# Altium schematic sheet 14.SchDoc
size 513 x 386 mm
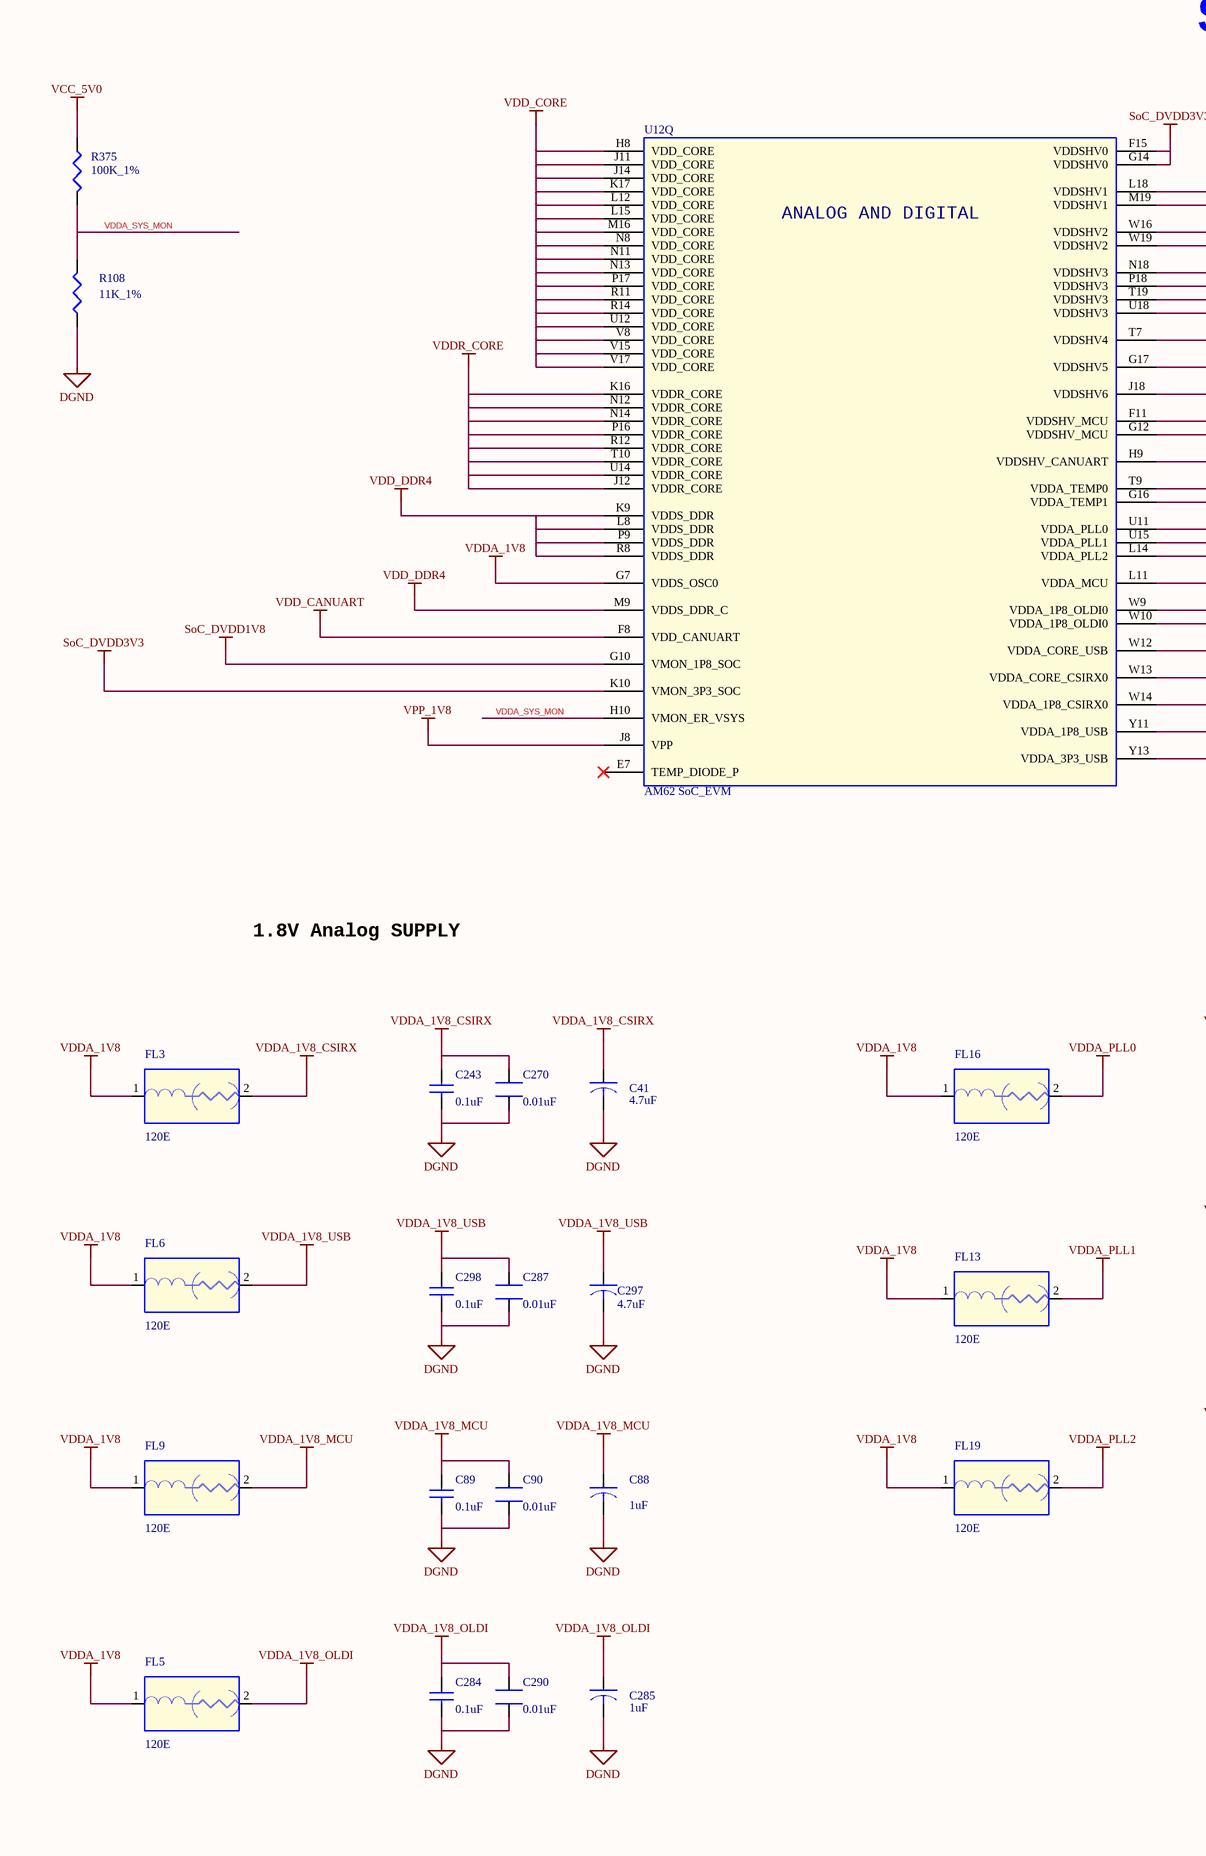
[diagram p0: 14.SchDoc, left]
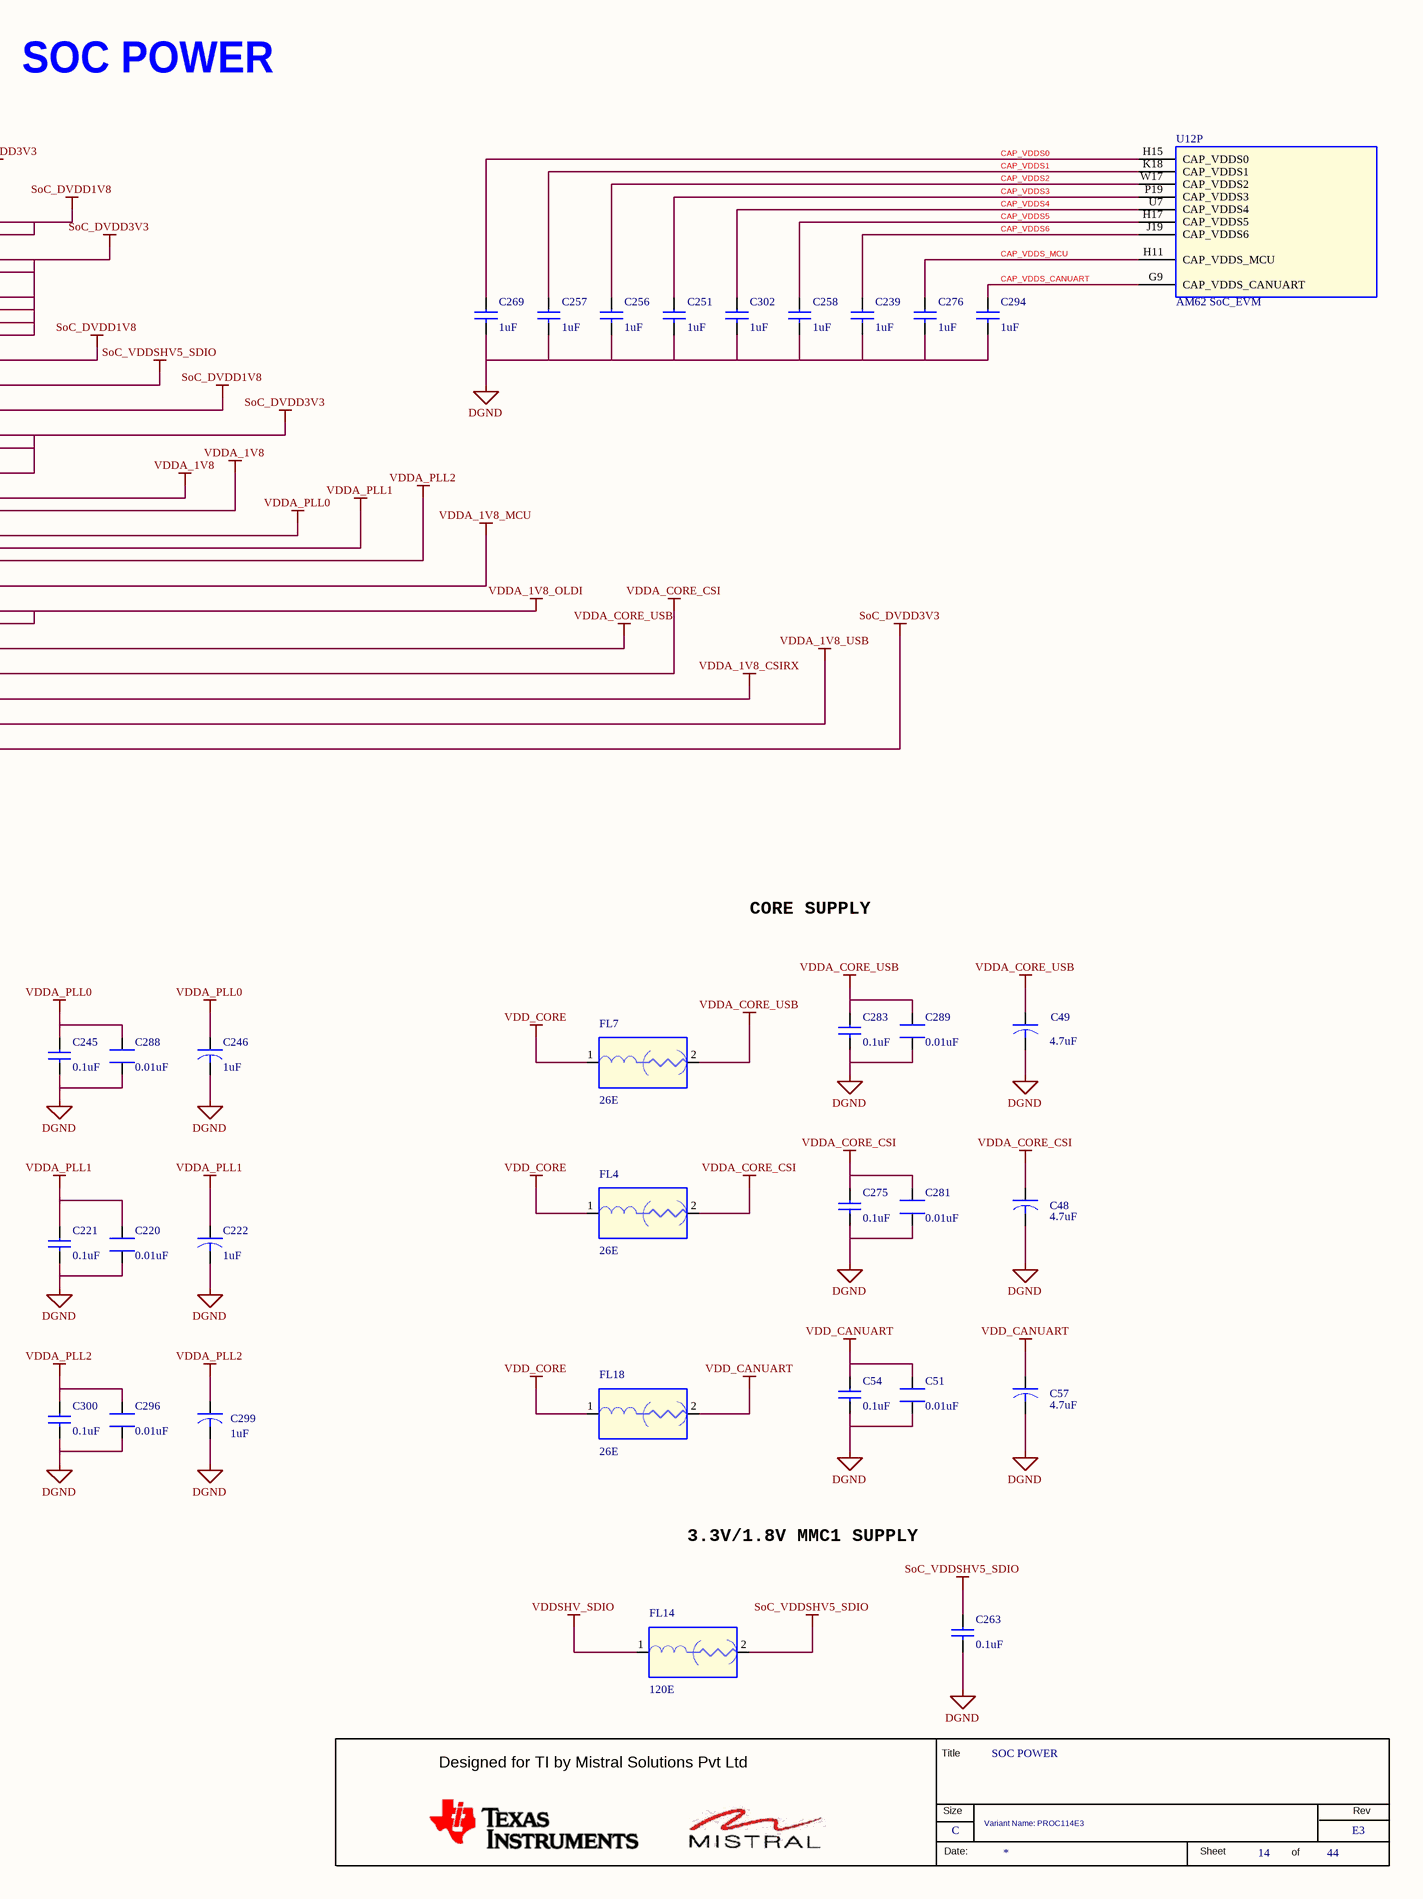
[diagram p1: 14.SchDoc, right]

## Parts
(Parts that share a designator on the sheet are numbered #1, #2 ... from top to bottom, then left to right.)
*  RevCode: E3  Title: SOC POWER  Page Size: C  Page Number: 14  Page Count: 44  Variant Name: PROC114E3  (hidden comment: MISTRAL_TITLEBLK_CSIZE)  (graphical)
C41  4.7uF  [CAP0402_0-75]
C48  4.7uF  [CAP0402_0-75]
C49  4.7uF  [CAP0402_0-75]
C51  0.01uF  [CAP0402N]
C54  0.1uF  [CAP0201_0-5]
C57  4.7uF  [CAP0402_0-75]
C88  1uF  [CAP0201_0-5]
C89  0.1uF  [CAP0201_0-5]
C90  0.01uF  [CAP0402N]
C220  0.01uF  [CAP0402N]
C221  0.1uF  [CAP0201_0-5]
C222  1uF  [CAP0201_0-5]
C239  1uF  [CAP0201_0-5]
C243  0.1uF  [CAP0201_0-5]
C245  0.1uF  [CAP0201_0-5]
C246  1uF  [CAP0201_0-5]
C251  1uF  [CAP0201_0-5]
C256  1uF  [CAP0201_0-5]
C257  1uF  [CAP0201_0-5]
C258  1uF  [CAP0201_0-5]
C263  0.1uF  [CAP0201_0-5]
C269  1uF  [CAP0201_0-5]
C270  0.01uF  [CAP0402N]
C275  0.1uF  [CAP0201_0-5]
C276  1uF  [CAP0201_0-5]
C281  0.01uF  [CAP0402N]
C283  0.1uF  [CAP0201_0-5]
C284  0.1uF  [CAP0201_0-5]
C285  1uF  [CAP0201_0-5]
C287  0.01uF  [CAP0402N]
C288  0.01uF  [CAP0402N]
C289  0.01uF  [CAP0402N]
C290  0.01uF  [CAP0402N]
C294  1uF  [CAP0201_0-5]
C296  0.01uF  [CAP0402N]
C297  4.7uF  [CAP0402_0-75]
C298  0.1uF  [CAP0201_0-5]
C299  1uF  [CAP0201_0-5]
C300  0.1uF  [CAP0201_0-5]
C302  1uF  [CAP0201_0-5]
FL3  120E  [EMIFIL_BLM15A_0402_0-6]
FL4  26E  [EMIFIL_BLM18K_0603_0-7]
FL5  120E  [EMIFIL_BLM15A_0402_0-6]
FL6  120E  [EMIFIL_BLM15A_0402_0-6]
FL7  26E  [EMIFIL_BLM18K_0603_0-7]
FL9  120E  [EMIFIL_BLM15A_0402_0-6]
FL13  120E  [EMIFIL_BLM15A_0402_0-6]
FL14  120E  [EMIFIL_BLM15A_0402_0-6]
FL16  120E  [EMIFIL_BLM15A_0402_0-6]
FL18  26E  [EMIFIL_BLM18K_0603_0-7]
FL19  120E  [EMIFIL_BLM15A_0402_0-6]
R108  11K_1%  [RES0402_0-5]
R375  100K_1%  [RES0402_0-5]
U12#1  AM62 SoC_EVM  [BGA425_19-68_510X510_0-7]  (part P of 18)
U12#2  AM62 SoC_EVM  [BGA425_19-68_510X510_0-7]  (part Q of 18)

## Nets
DGND: C41.2 C48.2 C49.2 C51.2 C54.2 C57.2 C88.2 C89.2 C90.2 C220.2 C221.2 C222.2 C239.2 C243.2 C245.2 C246.2 C251.2 C256.2 C257.2 C258.2 C263.2 C269.2 C270.2 C275.2 C276.2 C281.2 C283.2 C284.2 C285.2 C287.2 C288.2 C289.2 C290.2 C294.2 C296.2 C297.2 C298.2 C299.2 C300.2 C302.2 R108.2
SoC_DVDD1V8: U12#2.G10(VMON_1P8_SOC) U12#2.J18(VDDSHV6) U12#2.L18(VDDSHV1) U12#2.M19(VDDSHV1) U12#2.T7(VDDSHV4)
SoC_DVDD3V3: U12#2.F11(VDDSHV_MCU) U12#2.F15(VDDSHV0) U12#2.G12(VDDSHV_MCU) U12#2.G14(VDDSHV0) U12#2.H9(VDDSHV_CANUART) U12#2.K10(VMON_3P3_SOC) U12#2.N18(VDDSHV3) U12#2.P18(VDDSHV3) U12#2.T19(VDDSHV3) U12#2.U18(VDDSHV3) U12#2.W16(VDDSHV2) U12#2.W19(VDDSHV2) U12#2.Y13(VDDA_3P3_USB)
SoC_VDDSHV5_SDIO: C263.1 FL14.2 U12#2.G17(VDDSHV5)
VCC_5V0: R375.1
VDD_CANUART: C51.1 C54.1 C57.1 FL18.2 U12#2.F8(VDD_CANUART)
VDD_CORE: FL4.1 FL7.1 FL18.1 U12#2.H8(VDD_CORE) U12#2.J11(VDD_CORE) U12#2.J14(VDD_CORE) U12#2.K17(VDD_CORE) U12#2.L12(VDD_CORE) U12#2.L15(VDD_CORE) U12#2.M16(VDD_CORE) U12#2.N8(VDD_CORE) U12#2.N11(VDD_CORE) U12#2.N13(VDD_CORE) U12#2.P17(VDD_CORE) U12#2.R11(VDD_CORE) U12#2.R14(VDD_CORE) U12#2.U12(VDD_CORE) U12#2.V8(VDD_CORE) U12#2.V15(VDD_CORE) U12#2.V17(VDD_CORE)
VDD_DDR4: U12#2.K9(VDDS_DDR) U12#2.L8(VDDS_DDR) U12#2.M9(VDDS_DDR_C) U12#2.P9(VDDS_DDR) U12#2.R8(VDDS_DDR)
VDDA_1V8: FL3.1 FL5.1 FL6.1 FL9.1 FL13.1 FL16.1 FL19.1 U12#2.G7(VDDS_OSC0) U12#2.G16(VDDA_TEMP1) U12#2.T9(VDDA_TEMP0)
VDDA_1V8_CSIRX: C41.1 C243.1 C270.1 FL3.2 U12#2.W14(VDDA_1P8_CSIRX0)
VDDA_1V8_MCU: C88.1 C89.1 C90.1 FL9.2 U12#2.L11(VDDA_MCU)
VDDA_1V8_OLDI: C284.1 C285.1 C290.1 FL5.2 U12#2.W9(VDDA_1P8_OLDI0) U12#2.W10(VDDA_1P8_OLDI0)
VDDA_1V8_USB: C287.1 C297.1 C298.1 FL6.2 U12#2.Y11(VDDA_1P8_USB)
VDDA_CORE_CSI: C48.1 C275.1 C281.1 FL4.2 U12#2.W13(VDDA_CORE_CSIRX0)
VDDA_CORE_USB: C49.1 C283.1 C289.1 FL7.2 U12#2.W12(VDDA_CORE_USB)
VDDA_PLL0: C245.1 C246.1 C288.1 FL16.2 U12#2.U11(VDDA_PLL0)
VDDA_PLL1: C220.1 C221.1 C222.1 FL13.2 U12#2.U15(VDDA_PLL1)
VDDA_PLL2: C296.1 C299.1 C300.1 FL19.2 U12#2.L14(VDDA_PLL2)
VDDR_CORE: U12#2.J12(VDDR_CORE) U12#2.K16(VDDR_CORE) U12#2.N12(VDDR_CORE) U12#2.N14(VDDR_CORE) U12#2.P16(VDDR_CORE) U12#2.R12(VDDR_CORE) U12#2.T10(VDDR_CORE) U12#2.U14(VDDR_CORE)
VDDSHV_SDIO: FL14.1
VPP_1V8: U12#2.J8(VPP)
CAP_VDDS0: C269.1 U12#1.H15(CAP_VDDS0)
CAP_VDDS1: C257.1 U12#1.K18(CAP_VDDS1)
CAP_VDDS2: C256.1 U12#1.W17(CAP_VDDS2)
CAP_VDDS3: C251.1 U12#1.P19(CAP_VDDS3)
CAP_VDDS4: C302.1 U12#1.U7(CAP_VDDS4)
CAP_VDDS5: C258.1 U12#1.H17(CAP_VDDS5)
CAP_VDDS6: C239.1 U12#1.J19(CAP_VDDS6)
CAP_VDDS_CANUART: C294.1 U12#1.G9(CAP_VDDS_CANUART)
CAP_VDDS_MCU: C276.1 U12#1.H11(CAP_VDDS_MCU)
VDDA_SYS_MON: R108.1 R375.2 U12#2.H10(VMON_ER_VSYS)

Not connected (* = marked no-connect by the designer): U12#2 E7(TEMP_DIODE_P)*

## Notes on the sheet
- SOC POWER
- 1.8V Analog SUPPLY
- CORE SUPPLY
- 3.3V/1.8V MMC1 SUPPLY
- (in symbol AM62-EVM_BGA425, part Q) ANALOG AND DIGITAL
- (in symbol MISTRAL_TITLEBLK_CSIZE) Title; Designed for TI by Mistral Solutions Pvt Ltd; Size; Rev; Date:; Sheet; of

## Library data of the parts
* = MISTRAL_TITLEBLK_CSIZE: Issue: 1.0; Page Create Date: March  8, 1995; Page Modify Date: *; Schematic Page Count: 44; Schematic Page Number: 14
C41 = CAP_Dup1: CAP CERAMIC 4.7uF 10V 20% X5R 0402; Part_type: CAPACITORS\CERAMIC; Mfr_part_number: GRM155R61A475MEAAD; Mfr_name: MURATA; Mistral Part No: 120012060002-R; Custom_Duty: 15%; Customs_HS_Code: 85322990; Wattage: NA; Project: TI_J7SVB_PCIE_ADD-ON-CARD; Footprint Path: Y:\MIS_DATABASE\Library\ALTIUM_TOOL\PCB_FOOTPRINTS\Altium_Footprint_Lib.PcbLib; Library Path: Y:\MIS_DATABASE\Library\ALTIUM_TOOL\SCHEMATICS_PARTS\MS_DISCRETE_Library.schlib; MECHANICAL 3D STEP FILE: CAP0402_0-75; Chkd/date: MANIRAJA/110718; Crtd /date: ALVY/110718; Datasheet: Y:\MIS_DATABASE\DATASHEETS\CAPACITORS\GRM155R61A475MEAAD.PDF; Temperature: -55°C+85°C; Weight: 14mg; Height: 0.65MM; Library Ref: CAP; Distributor_part_number: 490-14306-1-ND; Distributor_name: DIGIKEY; Package: 0402; Voltage: 10V; Tolerance: 20%; Footprint Ref: CAP0402_0-75; PCB Footprint: CAP0402_0-75
C48 C49 C57 C297 = CAP_Dup1: CAP CERAMIC 4.7uF 10V 20% X5R 0402; Mistral Part No: 120012060002-R; Mfr_name: MURATA; Mfr_part_number: GRM155R61A475MEAAD; Part_type: CAPACITORS\CERAMIC; Project: TI_J7SVB_PCIE_ADD-ON-CARD; Wattage: NA; Customs_HS_Code: 85322990; Custom_Duty: 15%; PCB Footprint: CAP0402_0-75; Footprint Ref: CAP0402_0-75; Tolerance: 20%; Voltage: 10V; Package: 0402; Distributor_name: DIGIKEY; Distributor_part_number: 490-14306-1-ND; Library Ref: CAP; Height: 0.65MM; Weight: 14mg; Temperature: -55°C+85°C; Datasheet: Y:\MIS_DATABASE\DATASHEETS\CAPACITORS\GRM155R61A475MEAAD.PDF; Crtd /date: ALVY/110718; Chkd/date: MANIRAJA/110718; MECHANICAL 3D STEP FILE: CAP0402_0-75; Library Path: Y:\MIS_DATABASE\Library\ALTIUM_TOOL\SCHEMATICS_PARTS\MS_DISCRETE_Library.schlib; Footprint Path: Y:\MIS_DATABASE\Library\ALTIUM_TOOL\PCB_FOOTPRINTS\Altium_Footprint_Lib.PcbLib
C51 C288 = CAP_Dup3: CAP CERAMIC 0.01uF 25V 10% X5R 0201; Part_type: CAPACITORS\CERAMIC; Mfr_part_number: GRM033R61E103KA12J; Mfr_name: MURATA; Mistral Part No: 120018010007-R; PCB Footprint: CAP0201_0-5; Wattage: NA; Custom_Duty: 15%; Customs_HS_Code: 85322990; Project: TI_MAXIE_CPB; Footprint Path: Y:\MIS_DATABASE\Library\ALTIUM_TOOL\PCB_FOOTPRINTS\Altium_Footprint_Lib.PcbLib; Library Path: Y:\MIS_DATABASE\Library\ALTIUM_TOOL\SCHEMATICS_PARTS\MS_DISCRETE_Library.schlib; Footprint Ref: CAP0201_0-5; Library Ref: CAP; MECHANICAL 3D STEP FILE: CAP0201_0-5; Temperature: -55°C+85°C; Weight: 0.33mg; Chkd/date: MANIRAJA/230118; Crtd /date: MANIRAJA/230118; Datasheet: Y:\MIS_DATABASE\DATASHEETS\CAPACITORS\GRM033R61E103KA12.PDF; Height: 0.33MM; Distributor_part_number: GRM033R61E103KA12J-ND; Distributor_name: DIGIKEY; Package: 0201; Voltage: 25V; Tolerance: 10%
C54 C89 C243 C245 C275 C283 C284 C298 = CAP_Dup2: CAP CERAMIC 0.1uF 16V 10% X5R 0201; Part_type: CAPACITORS\CERAMIC; Mfr_part_number: GRM033R61C104KE14D; Mfr_name: MURATA; Mistral Part No: 120009030072-R; Custom_Duty: 15%; Customs_HS_Code: 85322990; Wattage: NA; Project: TI_MAXIE_CPB; PCB Footprint: CAP0201_0-5; Footprint Path: Y:\MIS_DATABASE\Library\ALTIUM_TOOL\PCB_FOOTPRINTS\Altium_Footprint_Lib.PcbLib; Library Path: Y:\MIS_DATABASE\Library\ALTIUM_TOOL\SCHEMATICS_PARTS\MS_DISCRETE_Library.schlib; Footprint Ref: CAP0201_0-5; MECHANICAL 3D STEP FILE: CAP0201_0-5; Chkd/date: MANIRAJA/230118; Crtd /date: MANIRAJA/230118; Datasheet: Y:\MIS_DATABASE\DATASHEETS\CAPACITORS\GRM033R61C104KE14.PDF; Temperature: -55°C+85°C; Weight: 0.33mg; Height: 0.33MM; Distributor_part_number: 490-14305-1-ND; Distributor_name: DIGIKEY; Package: 0201; Voltage: 16V; Tolerance: 10%; Library Ref: CAP
C88 C222 C285 C299 = CAP_Dup1: CAP CERAMIC 1uF 16V 20% X5R 0201; Part_type: CAPACITORS\CERAMIC; Mfr_part_number: GRM033R61C105ME15D; Mfr_name: MURATA; Mistral Part No: 120018090038-R; Custom_Duty: 15%; Customs_HS_Code: 85322990; Wattage: NA; Project: QCS610_NANOSOM; PCB Footprint: CAP0201_0-5; Footprint Path: Y:\MIS_DATABASE\Library\ALTIUM_TOOL\PCB_FOOTPRINTS\Altium_Footprint_Lib.PcbLib; Library Path: Y:\MIS_DATABASE\Library\ALTIUM_TOOL\SCHEMATICS_PARTS\MS_DISCRETE_Library.schlib; MECHANICAL 3D STEP FILE: CAP0201_0-5; Chkd/date: MANIRAJA/300520; Crtd /date: ALVY/260520; Datasheet: Y:\MIS_DATABASE\DATASHEETS\CAPACITORS\GRM033R61C105ME15.PDF; Temperature: -55°C+85°C; Weight: 0.33mg; Height: 0.39MM; Library Ref: CAP; Distributor_part_number: 490-18654-1-ND; Distributor_name: DIGIKEY; Package: 0201; Voltage: 16V; Tolerance: 20%; Footprint Ref: CAP0201_0-5
C90 C220 C270 C281 C287 C289 C290 C296 = CAP_Dup3: CAP CERAMIC 0.01uF 25V 10% X5R 0201; Mistral Part No: 120018010007-R; Mfr_name: MURATA; Mfr_part_number: GRM033R61E103KA12J; Part_type: CAPACITORS\CERAMIC; PCB Footprint: CAP0201_0-5; Project: TI_MAXIE_CPB; Customs_HS_Code: 85322990; Custom_Duty: 15%; Wattage: NA; Footprint Path: Y:\MIS_DATABASE\Library\ALTIUM_TOOL\PCB_FOOTPRINTS\Altium_Footprint_Lib.PcbLib; Library Path: Y:\MIS_DATABASE\Library\ALTIUM_TOOL\SCHEMATICS_PARTS\MS_DISCRETE_Library.schlib; Footprint Ref: CAP0201_0-5; Tolerance: 10%; Voltage: 25V; Package: 0201; Distributor_name: DIGIKEY; Distributor_part_number: GRM033R61E103KA12J-ND; Height: 0.33MM; Datasheet: Y:\MIS_DATABASE\DATASHEETS\CAPACITORS\GRM033R61E103KA12.PDF; Crtd /date: MANIRAJA/230118; Chkd/date: MANIRAJA/230118; Weight: 0.33mg; Temperature: -55°C+85°C; MECHANICAL 3D STEP FILE: CAP0201_0-5; Library Ref: CAP
C221 C263 C300 = CAP_Dup2: CAP CERAMIC 0.1uF 16V 10% X5R 0201; Mistral Part No: 120009030072-R; Mfr_name: MURATA; Mfr_part_number: GRM033R61C104KE14D; Part_type: CAPACITORS\CERAMIC; Project: TI_MAXIE_CPB; Wattage: NA; Customs_HS_Code: 85322990; Custom_Duty: 15%; PCB Footprint: CAP0201_0-5; Tolerance: 10%; Voltage: 16V; Package: 0201; Distributor_name: DIGIKEY; Distributor_part_number: 490-14305-1-ND; Height: 0.33MM; Weight: 0.33mg; Temperature: -55°C+85°C; Datasheet: Y:\MIS_DATABASE\DATASHEETS\CAPACITORS\GRM033R61C104KE14.PDF; Crtd /date: MANIRAJA/230118; Chkd/date: MANIRAJA/230118; MECHANICAL 3D STEP FILE: CAP0201_0-5; Library Ref: CAP; Footprint Ref: CAP0201_0-5; Library Path: Y:\MIS_DATABASE\Library\ALTIUM_TOOL\SCHEMATICS_PARTS\MS_DISCRETE_Library.schlib; Footprint Path: Y:\MIS_DATABASE\Library\ALTIUM_TOOL\PCB_FOOTPRINTS\Altium_Footprint_Lib.PcbLib
C239 C251 C257 C294 C302 = CAP_Dup2: CAP CERAMIC 1uF 16V 20% X5R 0201; Mistral Part No: 120018090038-R; Mfr_name: MURATA; Mfr_part_number: GRM033R61C105ME15D; Part_type: CAPACITORS\CERAMIC; Project: QCS610_NANOSOM; Wattage: NA; Customs_HS_Code: 85322990; Custom_Duty: 15%; PCB Footprint: CAP0201_0-5; Footprint Ref: CAP0201_0-5; Tolerance: 20%; Voltage: 16V; Package: 0201; Distributor_name: DIGIKEY; Distributor_part_number: 490-18654-1-ND; Library Ref: CAP; Height: 0.39MM; Weight: 0.33mg; Temperature: -55°C+85°C; Datasheet: Y:\MIS_DATABASE\DATASHEETS\CAPACITORS\GRM033R61C105ME15.PDF; Crtd /date: ALVY/260520; Chkd/date: MANIRAJA/300520; MECHANICAL 3D STEP FILE: CAP0201_0-5; Library Path: Y:\MIS_DATABASE\Library\ALTIUM_TOOL\SCHEMATICS_PARTS\MS_DISCRETE_Library.schlib; Footprint Path: Y:\MIS_DATABASE\Library\ALTIUM_TOOL\PCB_FOOTPRINTS\Altium_Footprint_Lib.PcbLib
C246 = CAP_Dup1: CAP CERAMIC 1uF 16V 20% X5R 0201; Mistral Part No: 120018090038-R; Mfr_name: MURATA; Mfr_part_number: GRM033R61C105ME15D; Part_type: CAPACITORS\CERAMIC; Project: QCS610_NANOSOM; Wattage: NA; Customs_HS_Code: 85322990; Custom_Duty: 15%; PCB Footprint: CAP0201_0-5; Footprint Ref: CAP0201_0-5; Tolerance: 20%; Voltage: 16V; Package: 0201; Distributor_name: DIGIKEY; Distributor_part_number: 490-18654-1-ND; Library Ref: CAP; Height: 0.39MM; Weight: 0.33mg; Temperature: -55°C+85°C; Datasheet: Y:\MIS_DATABASE\DATASHEETS\CAPACITORS\GRM033R61C105ME15.PDF; Crtd /date: ALVY/260520; Chkd/date: MANIRAJA/300520; MECHANICAL 3D STEP FILE: CAP0201_0-5; Library Path: Y:\MIS_DATABASE\Library\ALTIUM_TOOL\SCHEMATICS_PARTS\MS_DISCRETE_Library.schlib; Footprint Path: Y:\MIS_DATABASE\Library\ALTIUM_TOOL\PCB_FOOTPRINTS\Altium_Footprint_Lib.PcbLib
C256 C258 C269 C276 = CAP_Dup2: CAP CERAMIC 1uF 16V 20% X5R 0201; Part_type: CAPACITORS\CERAMIC; Mfr_part_number: GRM033R61C105ME15D; Mfr_name: MURATA; Mistral Part No: 120018090038-R; Custom_Duty: 15%; Customs_HS_Code: 85322990; Wattage: NA; Project: QCS610_NANOSOM; PCB Footprint: CAP0201_0-5; Footprint Path: Y:\MIS_DATABASE\Library\ALTIUM_TOOL\PCB_FOOTPRINTS\Altium_Footprint_Lib.PcbLib; Library Path: Y:\MIS_DATABASE\Library\ALTIUM_TOOL\SCHEMATICS_PARTS\MS_DISCRETE_Library.schlib; MECHANICAL 3D STEP FILE: CAP0201_0-5; Chkd/date: MANIRAJA/300520; Crtd /date: ALVY/260520; Datasheet: Y:\MIS_DATABASE\DATASHEETS\CAPACITORS\GRM033R61C105ME15.PDF; Temperature: -55°C+85°C; Weight: 0.33mg; Height: 0.39MM; Library Ref: CAP; Distributor_part_number: 490-18654-1-ND; Distributor_name: DIGIKEY; Package: 0201; Voltage: 16V; Tolerance: 20%; Footprint Ref: CAP0201_0-5
FL3 FL9 FL14 = EMIFILTER_IND: IND FERRITE BEAD CHIP 120E 2A 0402; Mistral Part No: 130013060022-R; Mfr_name: MURATA; Mfr_part_number: BLM15PX121SN1D; Part_type: INDUCTOR; Project: GEN_3-8; Tolerance: 25%; Voltage: NA; Customs_HS_Code: 85369090; Custom_Duty: 24%; Footprint Ref: EMIFIL_BLM15A_0402_0-6; Wattage: NA; Package: 0402; Distributor_name: DIGIKEY; Distributor_part_number: 490-9656-1-ND; Library Ref: EMIFILTER_IND; Height: 0.55MM; Weight: 1mg; Temperature: -55°C+125°C; Datasheet: Y:\MIS_DATABASE\DATASHEETS\DISCRETES\INDUCTORS\BLM15-SN1-SER.PDF; Crtd /date: USMAN/170613; Chkd/date: NAVEED/241114; MECHANICAL 3D STEP FILE: EMIFIL_BLM15A_0402_0-6; Library Path: Y:\MIS_DATABASE\Library\ALTIUM_TOOL\SCHEMATICS_PARTS\MS_FILTER_Library.schlib; Footprint Path: Y:\MIS_DATABASE\Library\ALTIUM_TOOL\PCB_FOOTPRINTS\Altium_Footprint_Lib.PcbLib; PCB Footprint: EMIFIL_BLM15A_0402_0-6
FL4 = EMIFILTER_IND: FERRITE CHIP 26E 6A 0603; Mistral Part No: 130013100028-R; Mfr_name: MURATA; Mfr_part_number: BLM18SG260TN1D; Part_type: FILTER; Project: DTRM_SBAND; Tolerance: 25%; Voltage: NA; Customs_HS_Code: 85412900; Custom_Duty: 15%; Wattage: NA; Package: 0603; Distributor_name: DIGIKEY; Distributor_part_number: 490-3995-1-ND; Library Ref: EMIFILTER_IND; Height: 0.65MM; Weight: 2mg; Temperature: -55°C+125°C; Datasheet: Y:\MIS_DATABASE\DATASHEETS\DISCRETES\INDUCTORS\BLM18K-SERIES.PDF; Crtd /date: USMAN/251013; Chkd/date: NAVEED/190115; MECHANICAL 3D STEP FILE: EMIFIL_BLM18K_0603_0-7; PCB Footprint: EMIFIL_BLM18K_0603_0-7
FL5 FL6 FL13 FL16 FL19 = EMIFILTER_IND: IND FERRITE BEAD CHIP 120E 2A 0402; Part_type: INDUCTOR; Mfr_part_number: BLM15PX121SN1D; Mfr_name: MURATA; Mistral Part No: 130013060022-R; Custom_Duty: 24%; Customs_HS_Code: 85369090; Wattage: NA; Tolerance: 25%; Project: GEN_3-8; Footprint Path: Y:\MIS_DATABASE\Library\ALTIUM_TOOL\PCB_FOOTPRINTS\Altium_Footprint_Lib.PcbLib; Library Path: Y:\MIS_DATABASE\Library\ALTIUM_TOOL\SCHEMATICS_PARTS\MS_FILTER_Library.schlib; MECHANICAL 3D STEP FILE: EMIFIL_BLM15A_0402_0-6; Chkd/date: NAVEED/241114; Crtd /date: USMAN/170613; Datasheet: Y:\MIS_DATABASE\DATASHEETS\DISCRETES\INDUCTORS\BLM15-SN1-SER.PDF; Temperature: -55°C+125°C; Weight: 1mg; Height: 0.55MM; Library Ref: EMIFILTER_IND; Distributor_part_number: 490-9656-1-ND; Distributor_name: DIGIKEY; Package: 0402; Voltage: NA; Footprint Ref: EMIFIL_BLM15A_0402_0-6; PCB Footprint: EMIFIL_BLM15A_0402_0-6
FL7 FL18 = EMIFILTER_IND: FERRITE CHIP 26E 6A 0603; Part_type: FILTER; Mfr_part_number: BLM18SG260TN1D; Mfr_name: MURATA; Mistral Part No: 130013100028-R; Custom_Duty: 15%; Customs_HS_Code: 85412900; Wattage: NA; Tolerance: 25%; Project: DTRM_SBAND; MECHANICAL 3D STEP FILE: EMIFIL_BLM18K_0603_0-7; Chkd/date: NAVEED/190115; Crtd /date: USMAN/251013; Datasheet: Y:\MIS_DATABASE\DATASHEETS\DISCRETES\INDUCTORS\BLM18K-SERIES.PDF; Temperature: -55°C+125°C; Weight: 2mg; Height: 0.65MM; Library Ref: EMIFILTER_IND; Distributor_part_number: 490-3995-1-ND; Distributor_name: DIGIKEY; Package: 0603; Voltage: NA; PCB Footprint: EMIFIL_BLM18K_0603_0-7
R108 = RESISTOR_Dup6: RES 11K 1/16W 1% 0402; Mistral Part No: 110015110012-R; Mfr_name: YAGEO AMERICA; Mfr_part_number: RC0402FR-0711KL; Part_type: RESISTORS\FIXED; Project: TI_VLAN_SWITCH; Voltage: NA; Customs_HS_Code: 85332119; Custom_Duty: 15%; Library Ref: RESISTOR; Tolerance: 1%; Wattage: 1/16W; Package: 0402; Distributor_name: DIGIKEY; Distributor_part_number: 311-11.0KLRCT-ND; Height: 0.40MM; Weight: 0.65mg; Temperature: -55°C+155°C; Datasheet: Y:\MIS_DATABASE\DATASHEETS\RESISTORS\RCXXXXL-SER_MAR18.PDF; Crtd /date: VASANTHA/251115; Chkd/date: VASANTHA/251115; MECHANICAL 3D STEP FILE: RES0402_0-5; Footprint Ref: RES0402_0-5; Library Path: Y:\MIS_DATABASE\Library\ALTIUM_TOOL\SCHEMATICS_PARTS\MS_DISCRETE_Library.schlib; Footprint Path: Y:\MIS_DATABASE\Library\ALTIUM_TOOL\PCB_FOOTPRINTS\Altium_Footprint_Lib.PcbLib; PCB Footprint: RES0402_0-5
R375 = RESISTOR_Dup4: RES 100K 1/10W 1% 0402; Part_type: RESISTORS\FIXED; Mfr_part_number: ERJ-2RKF1003X; Mfr_name: PANASONIC-ECG; Mistral Part No: 110009030187-R; Custom_Duty: 15%; Customs_HS_Code: 85332119; Voltage: NA; Project: J32; Chkd/date: VASANTHA/201216; Crtd /date: MAZHAR/130306; Datasheet: Y:\MIS_DATABASE\DATASHEETS\RESISTORS\PAN-ERJSER_NOV17.PDF; Temperature: -55°C+155°C; Weight: 0.8mg; Height: 0.40MM; Distributor_part_number: P100KLCT-ND; Distributor_name: DIGIKEY; Package: 0402; Wattage: 1/10W; Tolerance: 1%; MECHANICAL 3D STEP FILE: RES0402_0-5; Library Ref: RESISTOR; Footprint Ref: RES0402_0-5; Library Path: Y:\MIS_DATABASE\Library\ALTIUM_TOOL\SCHEMATICS_PARTS\MS_DISCRETE_Library.schlib; Footprint Path: Y:\MIS_DATABASE\Library\ALTIUM_TOOL\PCB_FOOTPRINTS\Altium_Footprint_Lib.PcbLib; PCB Footprint: RES0402_0-5
U12#1 = AM62-EVM_BGA425_Dup1: IC AM62 SoC MICROPROCESSOR BGA425; Part_type: ICS\DIGITAL\MICROPROCESSOR; Mfr_name: TEXAS INSTRUMENTS; Mistral Part No: 141221060001; Custom_Duty: 15%; Customs_HS_Code: 85423100; Wattage: NA; Project: AM62_EVM_BRD; Footprint Path: Y:\MIS_DATABASE\Library\ALTIUM_TOOL\PCB_FOOTPRINTS\Altium_Footprint_Lib.PcbLib; Library Path: Y:\MIS_DATABASE\Library\ALTIUM_TOOL\SCHEMATICS_PARTS\MS_MICROPROCESSOR_Library.schlib; MECHANICAL 3D STEP FILE: BGA425_19-68_510X510_0-7; RoHS: NA; Chkd/date: ALVY/110621; Crtd /date: MANIRAJA/110621; Datasheet: Y:\MIS_DATABASE\DATASHEETS\ICS\DIGITAL\MICROCONTROLLER\AM62-SoC_SVB.PDF; Temperature: NA; Weight: NA; Height: 0.65MM; Footprint Ref: BGA425_19-68_510X510_0-7; Library Ref: AM62-EVM_BGA425; Distributor_part_number: NA; Distributor_name: NA; Package: BGA425; Voltage: NA; Tolerance: NA; Mfr_part_number: AM62 SoC_EVM; PCB Footprint: BGA425_19-68_510X510_0-7
U12#2 = AM62-EVM_BGA425: IC AM62 SoC MICROPROCESSOR BGA425; Part_type: ICS\DIGITAL\MICROPROCESSOR; Mfr_name: TEXAS INSTRUMENTS; Mistral Part No: 141221060001; Custom_Duty: 15%; Customs_HS_Code: 85423100; Wattage: NA; Project: AM62_EVM_BRD; PCB Footprint: BGA425_19-68_510X510_0-7; Footprint Path: Y:\MIS_DATABASE\Library\ALTIUM_TOOL\PCB_FOOTPRINTS\Altium_Footprint_Lib.PcbLib; Library Path: Y:\MIS_DATABASE\Library\ALTIUM_TOOL\SCHEMATICS_PARTS\MS_MICROPROCESSOR_Library.schlib; MECHANICAL 3D STEP FILE: BGA425_19-68_510X510_0-7; RoHS: NA; Chkd/date: ALVY/110621; Crtd /date: MANIRAJA/110621; Datasheet: Y:\MIS_DATABASE\DATASHEETS\ICS\DIGITAL\MICROCONTROLLER\AM62-SoC_SVB.PDF; Temperature: NA; Weight: NA; Height: 0.65MM; Footprint Ref: BGA425_19-68_510X510_0-7; Library Ref: AM62-EVM_BGA425; Distributor_part_number: NA; Distributor_name: NA; Package: BGA425; Voltage: NA; Tolerance: NA; Mfr_part_number: AM62 SoC_EVM